# Altium schematic sheet Controller.SchDoc
size A4
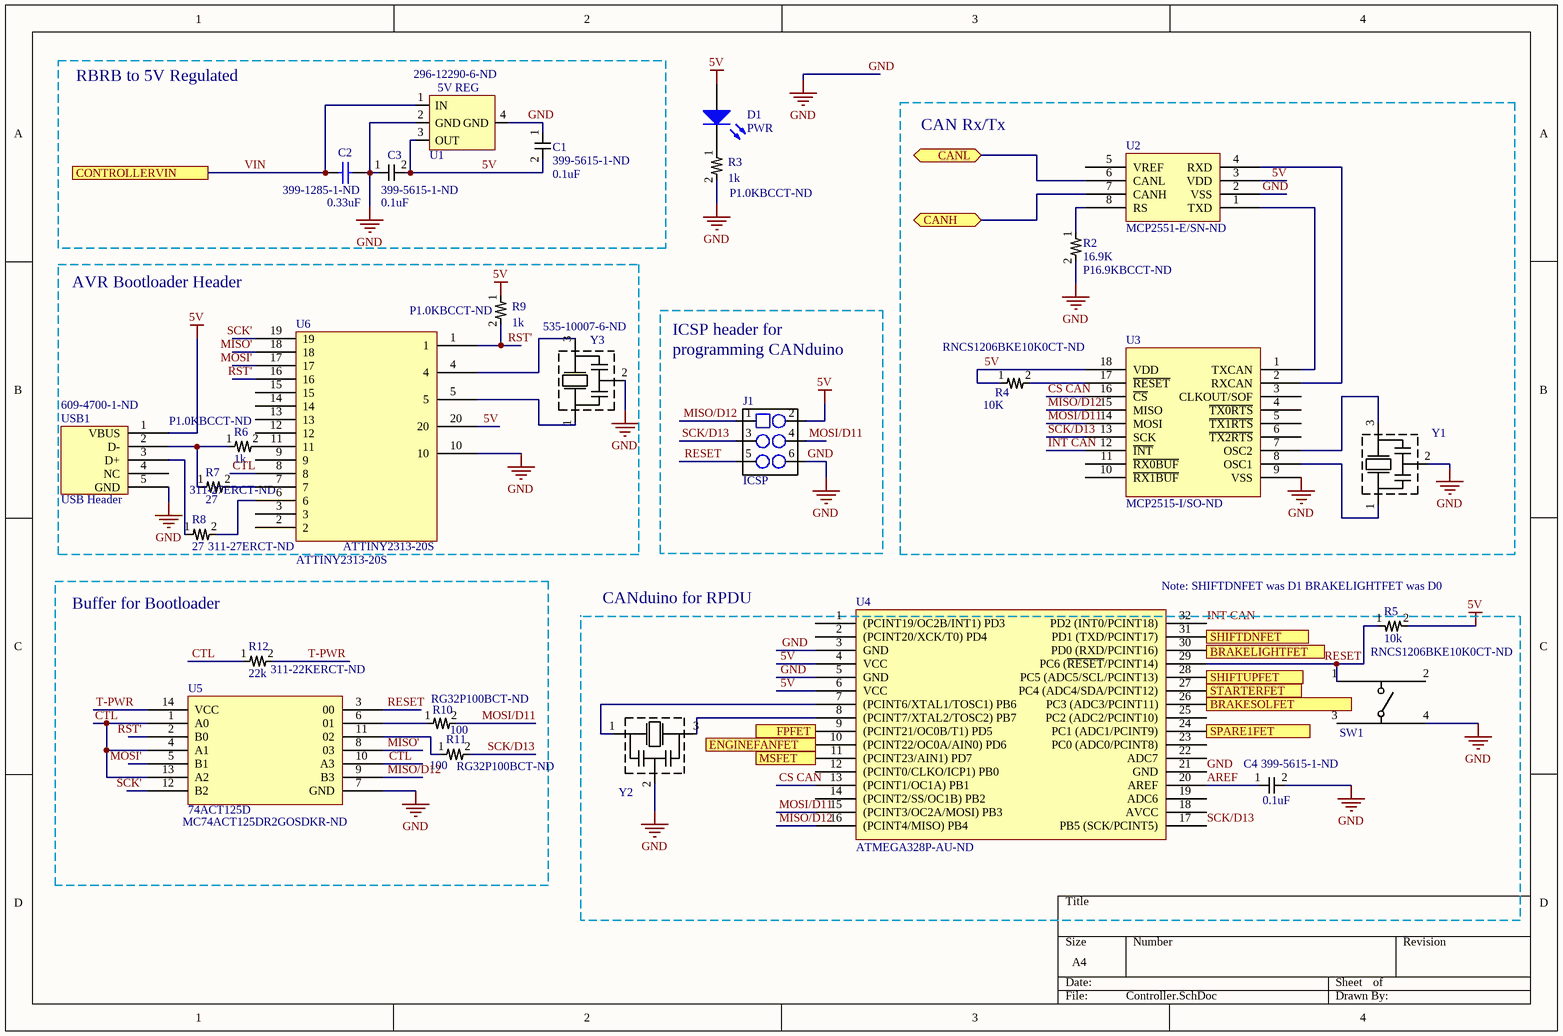
[diagram p0: Controller.SchDoc]

## Parts
C1  0.1uF  Supplier Part Number 1: 399-5615-1-ND  [C1206]
C2  value 0.33uF  Supplier Part Number 1: 399-1285-1-ND  [C1206]
C3  0.1uF  Supplier Part Number 1: 399-5615-1-ND  [C1206]
C4  0.1uF  Supplier Part Number 1: 399-5615-1-ND  [C1206]
D1  PWR  [3.2X1.6X1.1]
J1  ICSP  [ICSP Connector]
R2  16.9K  Supplier Part Number 1: P16.9KBCCT-ND  [C1206]
R3  1k  Supplier Part Number 1: P1.0KBCCT-ND  [C1206]
R4  10K  Supplier Part Number 1: RNCS1206BKE10K0CT-ND  [C1206]
R5  10k  Supplier Part Number 2: RNCS1206BKE10K0CT-ND  [C1206]
R6  1k  Supplier Part Number 1: P1.0KBCCT-ND  [C1206]
R7  27  Supplier Part Number 1: 311-27ERCT-ND  [C1206]
R8  27  Supplier Part Number 1: 311-27ERCT-ND  [C1206]
R9  1k  Supplier Part Number 1: P1.0KBCCT-ND  [C1206]
R10  100  Supplier Part Number 1: RG32P100BCT-ND  [C1206]
R11  100  Supplier Part Number 1: RG32P100BCT-ND  [C1206]
R12  22k  Supplier Part Number 1: 311-22KERCT-ND  [C1206]
SW1  PTS525SM15SMTR2  [PTS525SM15SMTR2]  (value not drawn)
U1  Supplier Part Number 1: 296-12290-6-ND  [SOT223]  (hidden comment: UA7805CKTTR)
U2  Supplier Part Number 1: MCP2551-E/SN-ND  [SOIC127P600X175-8M]  (hidden comment: MCP2551-E/SN)
U3  Supplier Part Number 1: MCP2515-I/SO-ND  [SOIC127P1030X265-18M]  (hidden comment: MCP2515-E/ST)
U4  Supplier Part Number 1: ATMEGA328P-AU-ND  [ATMEGA328P-15AZ - 2]  (hidden comment: ATMEGA328P)
U5  74ACT125D  Supplier Part Number 1: MC74ACT125DR2GOSDKR-ND  [14 pin buffer]
U6  ATTINY2313-20S  [ATTINY]
USB1  USB Header  Supplier Part Number 1: 609-4700-1-ND  [USBminiB]
Y1  CSTCE16M0V53-R0  [CSTCE16M0V53-R0]  (value not drawn)
Y2  CSTCE16M0V53-R0  [CSTCE16M0V53-R0]  (value not drawn)
Y3  Supplier Part Number 1: 535-10007-6-ND  [12MHzCRES]  (hidden comment: CSTCE16M0V53-R0)

## Blocks framed on the sheet
RBRB to 5V Regulated: C1-C3 U1
CAN Rx/Tx: R2 R4 U2 U3 Y1
AVR Bootloader Header: R6-R9 U6 USB1 Y3
Buffer for Bootloader: R10-R12 U5

## Ports
BRAKELIGHTFET, BRAKESOLFET, CANH (bidir), CANL (bidir), CONTROLLERVIN, ENGINEFANFET, FPFET, MSFET, SHIFTDNFET, SHIFTUPFET, SPARE1FET, STARTERFET

## Nets
5V: C1.2 C3.2 D1.1(A) J1.2 R4.1 R5.2 R9.1 U1.3(OUT) U2.3(VDD) U3.18(VDD) U4.4(VCC) U4.6(VCC) U6.20 USB1.1(VBUS)
GND: C1.1 C2.2 C3.1 C4.2 J1.6 R2.2 R3.2 SW1.4 U1.2(GND) U1.4(GND) U2.2(VSS) U3.9(VSS) U4.3(GND) U4.5(GND) U4.21(GND) U5.7(GND) U6.10 USB1.5(GND) Y1.2 Y2.2 Y3.2
AREF: C4.1 U4.20(AREF)
BRAKESOLFET: U4.26(PC3_(ADC3/PCINT11)) ; port BRAKESOLFET
CANH: U2.7(CANH) ; port CANH
CANL: U2.6(CANL) ; port CANL
CS CAN: U3.16(~{CS}) U4.13((PCINT1/OC1A)_PB1)
CTL: R12.1 U5.1(A0) U5.4(A1) U5.10(A3) U5.13(A2) U6.8
ENGINEFANFET: U4.10((PCINT22/OC0A/AIN0)_PD6) ; port ENGINEFANFET
FPFET: U4.9((PCINT21/OC0B/T1)_PD5) ; port FPFET
INT CAN: U3.12(~{INT}) U4.32(PD2_(INT0/PCINT18))
MISO': U5.8(03) U6.18
MISO/D12: J1.1 U3.15(MISO) U4.16((PCINT4/MISO)_PB4) U5.9(B3)
MOSI': U5.5(B1) U6.17
MOSI/D11: J1.4 R10.2 U3.14(MOSI) U4.15((PCINT3/OC2A/MOSI)_PB3)
MSFET: U4.11((PCINT23/AIN1)_PD7) ; port MSFET
RESET: J1.5 R5.1 SW1.1 U4.29(PC6_(~{RESET}/PCINT14)) U5.3(00)
RST': R9.2 U5.2(B0) U6.1 U6.16
SCK': U5.12(B2) U6.19
SCK/D13: J1.3 R11.2 U3.13(SCK) U4.17(PB5_(SCK/PCINT5))
SHIFTDNFET: U4.31(PD1_(TXD/PCINT17)) ; port SHIFTDNFET
SHIFTUPFET: U4.28(PC5_(ADC5/SCL/PCINT13)) ; port SHIFTUPFET
SPARE1FET: U4.24(PC1_(ADC1/PCINT9)) ; port SPARE1FET
STARTERFET: U4.27(PC4_(ADC4/SDA/PCINT12)) ; port STARTERFET
T-PWR: R12.2 U5.14(VCC)
VIN: C2.1 U1.1(IN) ; port CONTROLLERVIN
NetD1_2: D1.2(K) R3.1
NetR2_1: R2.1 U2.8(RS)
NetR4_2: R4.2 U3.17(~{RESET})
NetR6_1: R6.1 R7.1 USB1.2(D-)
NetR7_2: R7.2 U6.7
NetR8_1: R8.1 USB1.3(D+)
NetR8_2: R8.2 U6.6
NetR10_1: R10.1 U5.6(01)
NetR11_1: R11.1 U5.11(02)
NetU2_1: U2.1(TXD) U3.1(TXCAN)
NetU2_4: U2.4(RXD) U3.2(RXCAN)
NetU3_7: U3.7(OSC2) Y1.3
NetU3_8: U3.8(OSC1) Y1.1
NetU4_7: U4.7((PCINT6/XTAL1/TOSC1)_PB6) Y2.1
NetU4_8: U4.8((PCINT7/XTAL2/TOSC2)_PB7) Y2.3
NetU6_4: U6.4 Y3.3
NetU6_5: U6.5 Y3.1

Not connected (* = marked no-connect by the designer): R6 2; SW1 2 3; U2 5(VREF); U3 3(CLKOUT/SOF) 4(~{TX0RTS}) 5(~{TX1RTS}) 6(~{TX2RTS}) 10(~{RX1BUF}) 11(~{RX0BUF}); U4 1((PCINT19/OC2B/INT1)_PD3) 2((PCINT20/XCK/T0)_PD4) 12((PCINT0/CLKO/ICP1)_PB0) 14((PCINT2/SS/OC1B)_PB2) 18(AVCC) 19(ADC6) 22(ADC7) 23(PC0_(ADC0/PCINT8)) 25(PC2_(ADC2/PCINT10)) 30(PD0_(RXD/PCINT16)); U6 2 3 9 11 12 13 14 15; USB1 4(NC)

## Notes on the sheet
- ICSP header for
- programming CANduino
- CANduino for RPDU
- Note: SHIFTDNFET was D1 BRAKELIGHTFET was D0
- (in symbol UA7805CKTTR) 5V REG

## Library data of the parts
C1 C4 = Capacitor: 0603; Supplier 1: Digi-Key
C2 = Cap Semi: Capacitor (Semiconductor SIM Model); Published: 8-Jun-2000; LatestRevisionDate: 29-May-2009; LatestRevisionNote: IPC-7351 Footprint Added.; PackageReference: C1206; Publisher: Altium Limited; PackageDescription: Chip Capacitor; Supplier 1: Digi-Key
C3 = Capacitor: Supplier 1: Digi-Key
D1 = LED2: Typical RED, GREEN, YELLOW, AMBER GaAs LED; Published: 8-Jun-2000; LatestRevisionDate: 17-Jul-2002; LatestRevisionNote: Re-released for DXP Platform.; PackageVersion: Feb-2002; PackageReference: 3.2X1.6X1.1; Publisher: Altium Limited; PackageDescription: SM LED; 2 Flat Leads; Supplier 1: Digi-Key; Supplier Part Number 1: 160-1456-1-ND
J1 = ICSP Connector: Supplier 1: Digi-Key; Supplier Part Number 1: 952-2121-ND
R2 R4 R9 = Resistor: 0603; Supplier 1: Digi-Key
R3 R5-R8 R10-R12 = Resistor: 1206; Supplier 1: Digi-Key
  R5: Supplier 2: Digi-Key
U1 = UA7805CKTTR: 12V to 5V LDO 296-12290-1-ND; Supplier 1: Digi-Key
U2 = MCP2551-E/SN: SOIC; Supplier 1: Digi-Key
U3 = MCP2515-E/ST: SOIC; Supplier 1: Digi-Key
U4 = ATMEGA328P: TQFN; Supplier 1: Digi-Key
U5 = 74ACT125D: Buffer MC74ACT125DR2GOSCT-ND; Supplier 1: Digi-Key
U6 = ATTINY2313-20S: ATTINY; Supplier 1: Digi-Key; Supplier Part Number 1: ATTINY2313-20SURCT-ND
USB1 = USB Header: USB mini B 609-4700-1-ND; Supplier 1: Digi-Key
Y1 Y3 = CSTCE16M0V53-R0: 16MHz 15pf resonator 490-1198-1-ND; Supplier 1: Digi-Key
  Y1: Supplier Part Number 1: 490-1198-1-ND
SW1 = PTS525SM15SMTR2: Supplier 1: Digi-Key; Supplier Part Number 1: CKN9104CT-ND
Y2 = CSTCE16M0V53-R0: Supplier 1: Digi-Key; Supplier Part Number 1: 490-1198-1-ND